# EasyEDA Pro project 51单片机（STC89C52RC）核心板.epro

# Schematic Schematic1

## Sheets
1 MCU: Board Name: Board1; Create Date: 2025-09-20; Page Name: MCU; Project Name: 51单片机（STC89C52RC）核心板; Schematic Name: Schematic1; Update Date: 2025-09-26; Company: 嘉立创EDA; Page Size: A4; Version: V1.0
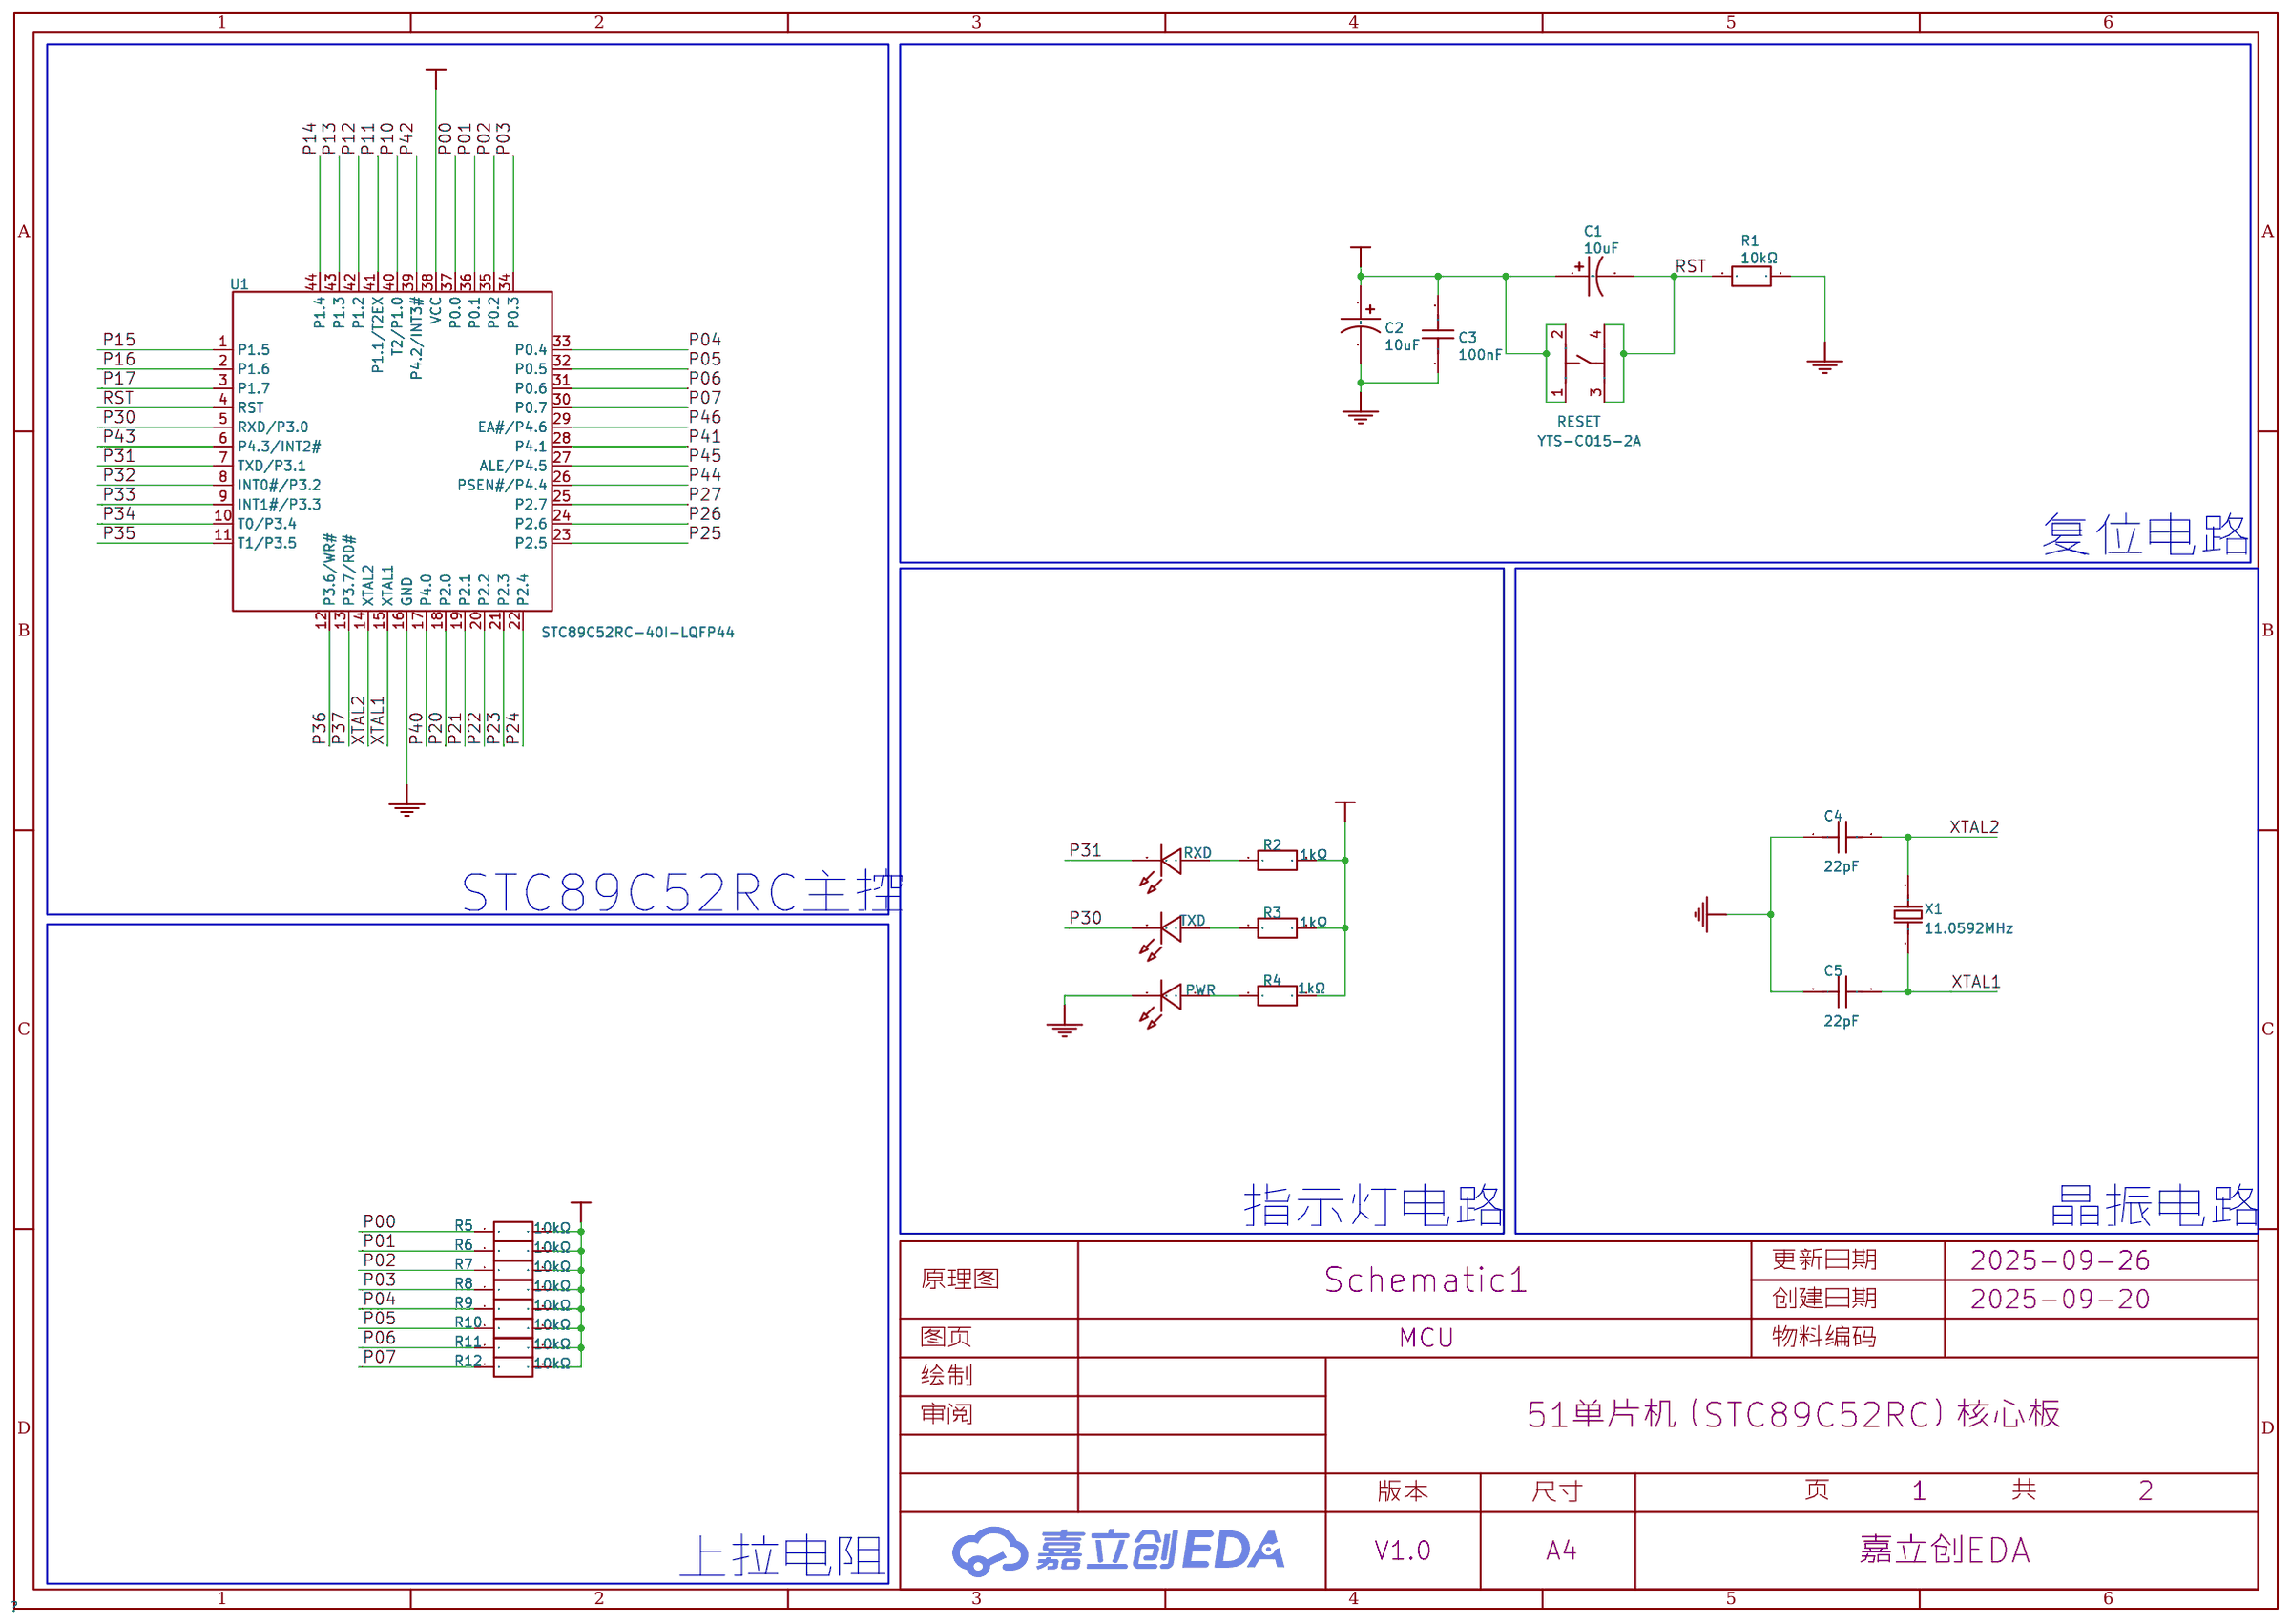
[diagram p0: MCU]
2 EX: Create Date: 2025-09-26; Page Name: EX; Update Date: 2025-09-27
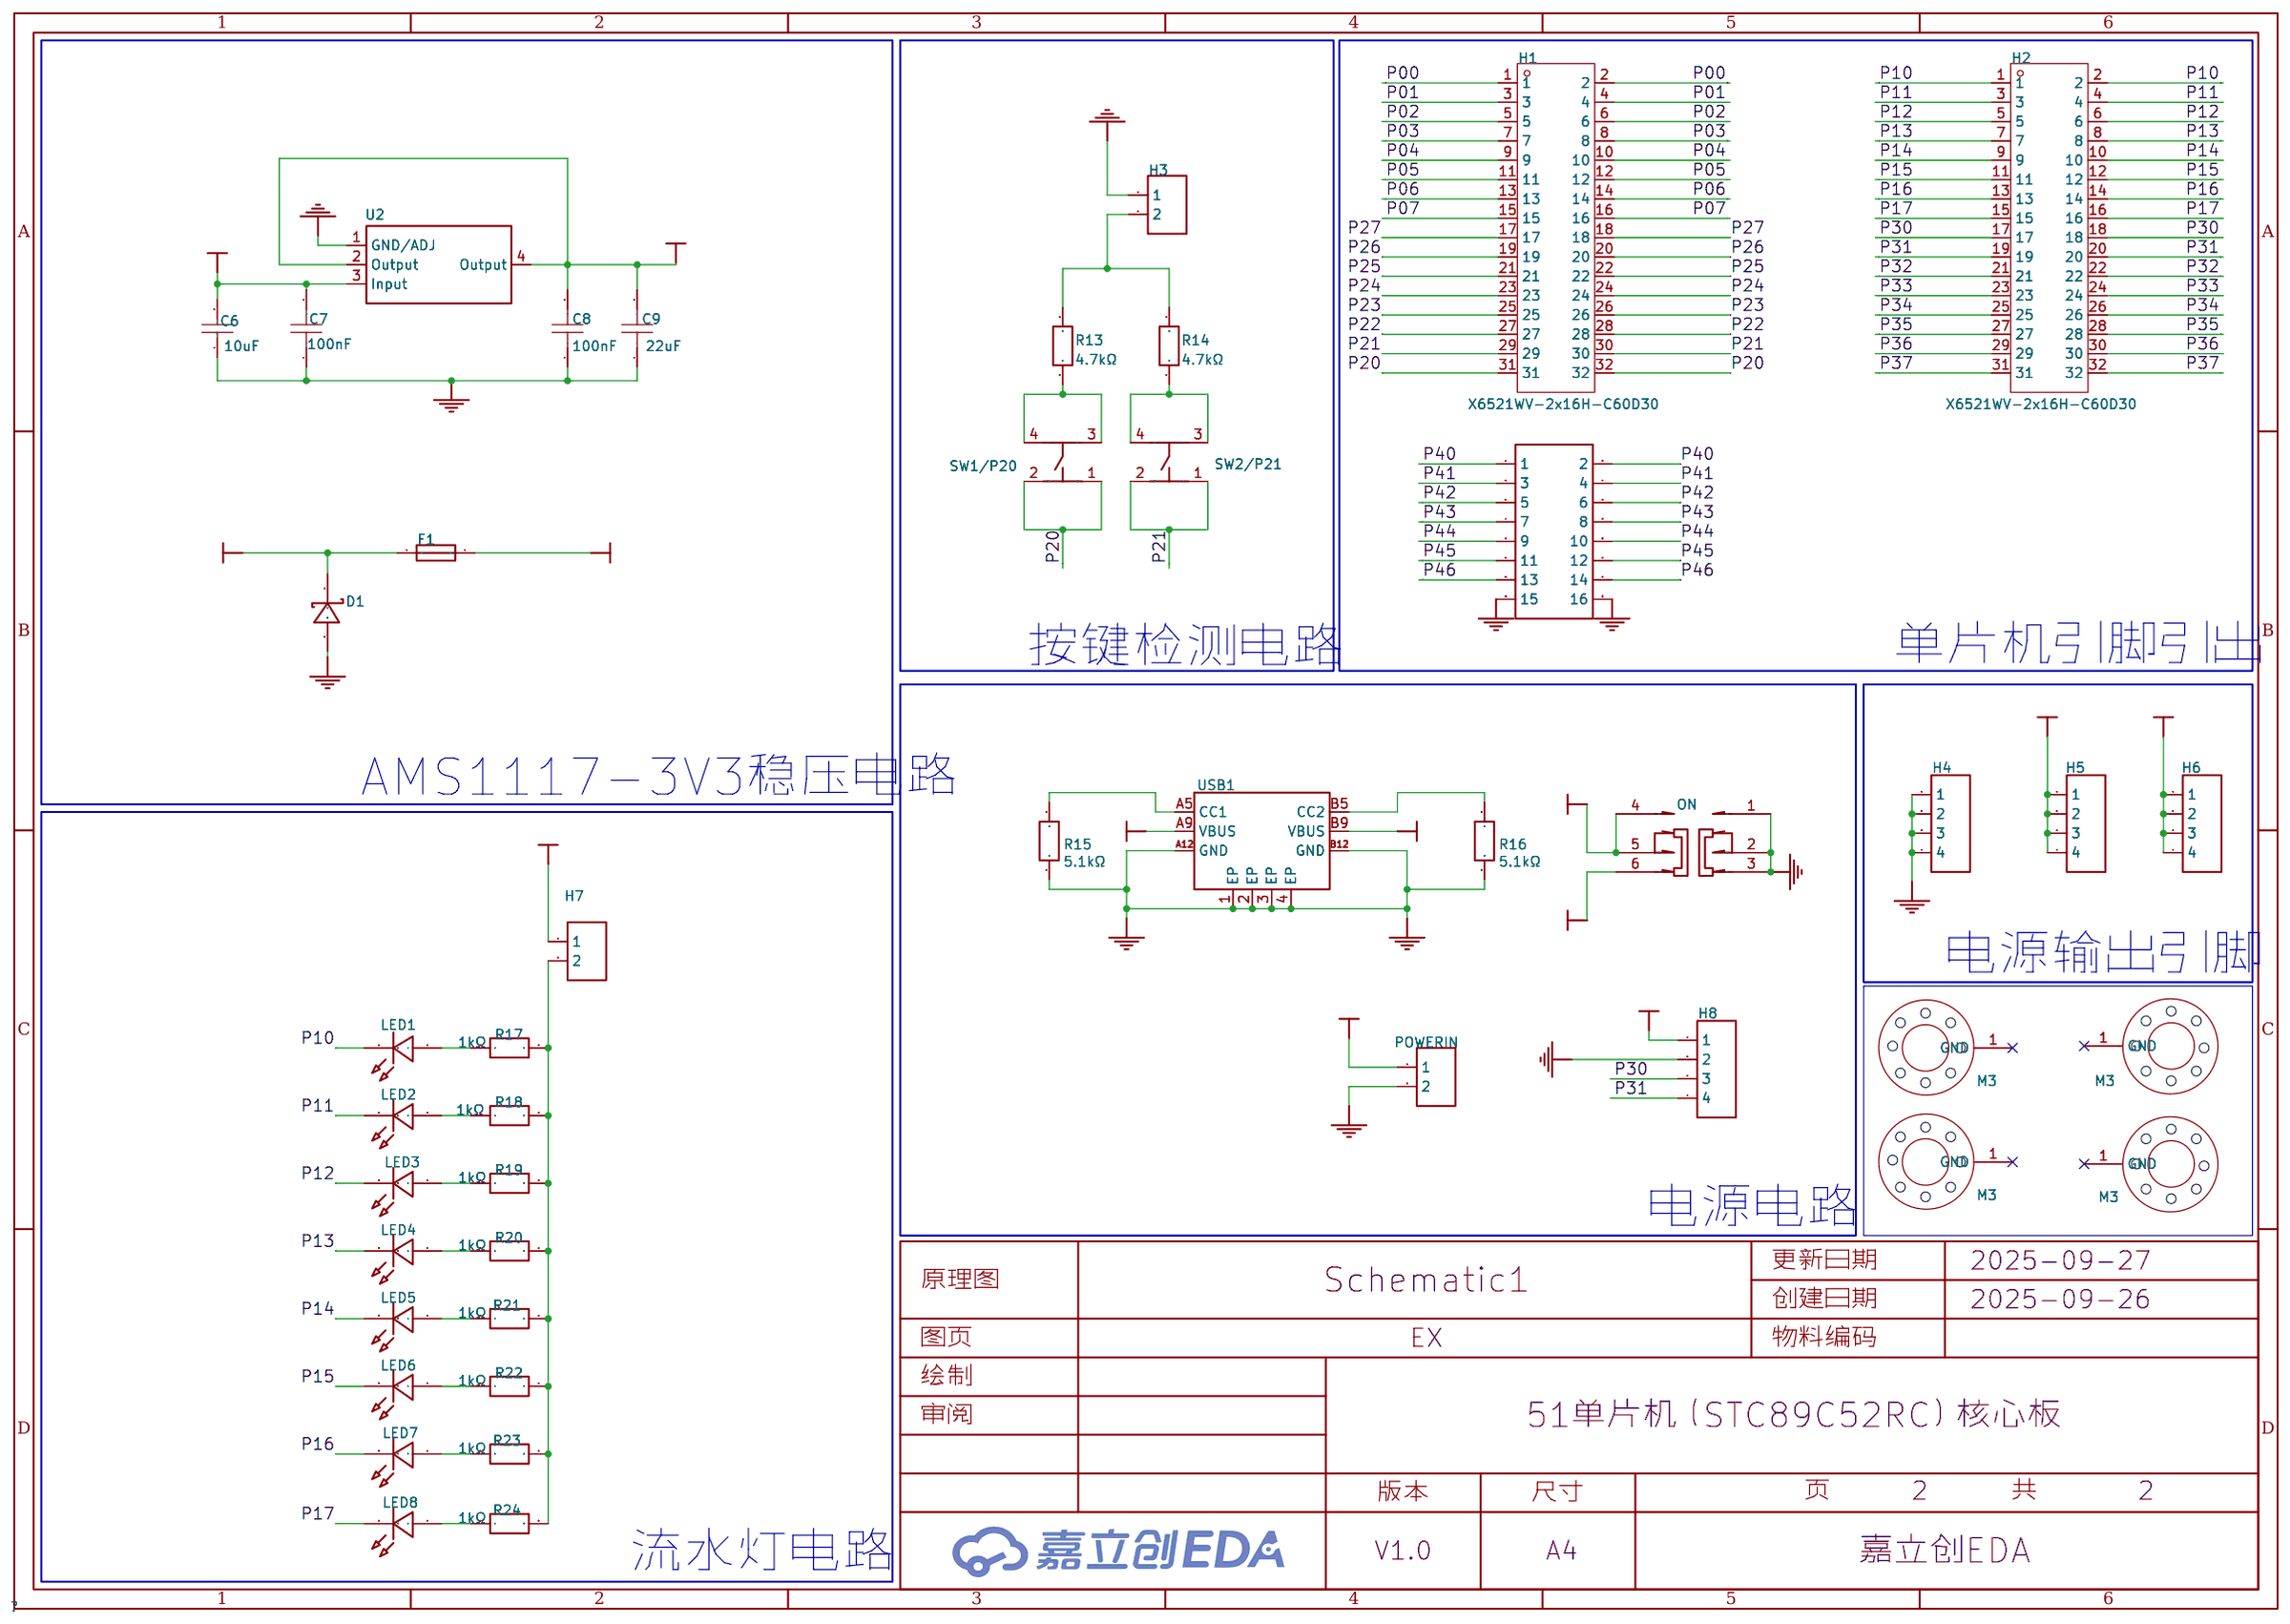
[diagram p1: EX]

## Parts
sheet EX
C6  10uF  [C0805]
C7  100nF  [C0805]
C8  100nF  [C0805]
C9  22uF  [C0805]
D1  1N5819W  [SOD-123F_L2.8-W1.8-LS3.7-RD]
F1  FSMD050-1206-R  [F1206]
H1  X6521WV-2x16H-C60D30  [HDR-TH_32P-2.54-V-M-R2-C16-S2.54]
H2  X6521WV-2x16H-C60D30  [HDR-TH_32P-2.54-V-M-R2-C16-S2.54]
H3  2.54-1*2P母  [HDR-TH_2P-P2.54-V-F]
H4  A2541HWV-4P  [HDR-TH_4P-P2.54-V_A2541HWV-4P]
H5  A2541HWV-4P  [HDR-TH_4P-P2.54-V_A2541HWV-4P]
H6  A2541HWV-4P  [HDR-TH_4P-P2.54-V_A2541HWV-4P]
H7  2.54-1*2P母  [HDR-TH_2P-P2.54-V-F]
H8  A2541HWV-4P  [HDR-TH_4P-P2.54-V_A2541HWV-4P]
hole1  M3  [m3梅花孔]
hole2  M3  [m3梅花孔]
hole3  M3  [m3梅花孔]
hole4  M3  [m3梅花孔]
J1  2.54-2*8P针  [HDR-TH_16P-P2.54-V-M-R2-C8-S2.54]
LED1  D-B080508B1-KS2  [LED0805-RD]
LED2  D-B080508B1-KS2  [LED0805-RD]
LED3  D-B080508B1-KS2  [LED0805-RD]
LED4  D-B080508B1-KS2  [LED0805-RD]
LED5  D-B080508B1-KS2  [LED0805-RD]
LED6  D-B080508B1-KS2  [LED0805-RD]
LED7  D-B080508B1-KS2  [LED0805-RD]
LED8  D-B080508B1-KS2  [LED0805-RD]
ON  SS-3235S-L1  [SW-SMD_SS-3235S-LX]
POWERIN  2.54-1*2P母  [HDR-TH_2P-P2.54-V-F]
R13  4.7kΩ  [R0805]
R14  4.7kΩ  [R0805]
R15  5.1kΩ  [R0805]
R16  5.1kΩ  [R0805]
R17  1kΩ  [R0805]
R18  1kΩ  [R0805]
R19  1kΩ  [R0805]
R20  1kΩ  [R0805]
R21  1kΩ  [R0805]
R22  1kΩ  [R0805]
R23  1kΩ  [R0805]
R24  1kΩ  [R0805]
SW1/P20  YTS-C015-2A  [SW-SMD_4P-L4.5-W4.5-P3.00-LS6.8]
SW2/P21  YTS-C015-2A  [SW-SMD_4P-L4.5-W4.5-P3.00-LS6.8]
U2  AMS1117-3.3  [SOT-223-4_L6.5-W3.5-P2.30-LS7.0-BR]
USB1  KH-TYPE-C-6P  [TYPE-C-SMD_TYPE-C-31-M-16]
sheet MCU
C1  10uF  [CASE-A_3216]
C2  10uF  [CASE-A_3216]
C3  100nF  [C0805]
C4  22pF  [C0805]
C5  22pF  [C0805]
PWR  D-B080508B1-KS2  [LED0805-RD]
R1  10kΩ  [R0805]
R2  1kΩ  [R0805]
R3  1kΩ  [R0805]
R4  1kΩ  [R0805]
R5  10kΩ  [R0805]
R6  10kΩ  [R0805]
R7  10kΩ  [R0805]
R8  10kΩ  [R0805]
R9  10kΩ  [R0805]
R10  10kΩ  [R0805]
R11  10kΩ  [R0805]
R12  10kΩ  [R0805]
RESET  YTS-C015-2A  [SW-SMD_4P-L4.5-W4.5-P3.00-LS6.8]
RXD  D-B080508B1-KS2  [LED0805-RD]
TXD  D-B080508B1-KS2  [LED0805-RD]
U1  STC89C52RC-40I-LQFP44  [LQFP-44_L10.0-W10.0-P0.80-LS12.0-BL]
X1  11.0592MHz  [HC-49US_L11.5-W4.5-P4.88]

## Library data of the parts
C6 = CL21A106KOQNNNE: 容值:10uF;精度:±10%;额定电压:16V;温度系数:X5R;; LCSC Part Name: 10uF ±10% 16V; Supplier Part: C1713; Manufacturer: SAMSUNG(三星); Supplier Footprint: 0805; JLCPCB Part Class: 扩展库; Datasheet: https://item.szlcsc.com/datasheet/CL21A106KOQNNNE/2065.html; Supplier: LCSC; Tolerance: ±10%; Voltage Rating: 16V; Temperature Coefficient: X5R
C7 C8 = FCC0805B104K500DT: 容值:100nF;精度:±10%;额定电压:50V;温度系数:X7R;; LCSC Part Name: 100nF ±10% 50V; Supplier Part: C5137467; Manufacturer: FOJAN(富捷); Supplier Footprint: 0805; JLCPCB Part Class: 扩展库; Datasheet: https://item.szlcsc.com/datasheet/FCC0805B104K500DT/5746969.html; Supplier: LCSC; Tolerance: ±10%; Voltage Rating: 50V; Temperature Coefficient: X7R
C9 = FCC0805X226M250FT: 容值:22uF;精度:±20%;额定电压:25V;温度系数:X5R;; LCSC Part Name: 22uF ±20% 25V; Supplier Part: C7419435; Manufacturer: FOJAN(富捷); Supplier Footprint: 0805; JLCPCB Part Class: 扩展库; Datasheet: https://item.szlcsc.com/datasheet/FCC0805X226M250FT/8393417.html; Supplier: LCSC; Tolerance: ±20%; Voltage Rating: 25V; Temperature Coefficient: X5R
D1 = 1N5819W_C169540: 正向压降(Vf):600mV@1A;直流反向耐压(Vr):40V;整流电流:1A;; LCSC Part Name: 电压:40V 电流:1A; Supplier Part: C169540; Manufacturer: 晶导微电子; Supplier Footprint: SOD-123F; JLCPCB Part Class: Extended Part; Datasheet: https://item.szlcsc.com/datasheet/1N5819W/180925.html; Supplier: LCSC; Voltage - Forward(Vf@If): 600mV@1A; Voltage - DC Reverse(Vr): 40V; Current - Rectified: 1A; Reverse Leakage Current (Ir): 1mA@40V; Operating Junction Temperature Range: -55℃~+150℃; Non-Repetitive Peak Forward Surge Current: 25A
F1 = FSMD050-1206-R: 耐压(Vmax):8V;最大电流(Imax):100A;保持电流(Ihold):500mA;跳闸电流(Itrip):1A;; LCSC Part Name: 8V 500mA 1206自恢复; Supplier Part: C220147; Manufacturer: FUZETEC(富致); Supplier Footprint: 1206; JLCPCB Part Class: Extended Part; Datasheet: https://item.szlcsc.com/datasheet/FSMD050-1206-R/220720.html; Supplier: LCSC; Voltage - Max: 8V; Current - Max: 100A; Hold Current: 500mA; Trip Current: 1A; Time to Trip(Max): 100ms; Operating Temperature: -40℃~+85℃; Length: 3.5mm; Width: 1.8mm; Height: 0.55mm
H1 H2 = X6521WV-2x16H-C60D30: 插针结构:2x16P;间距:2.54mm;行距:2.54mm;圆针/方针:方针;排数:双排;总PIN位数:32P;额定电流:3A;额定电压:250V;配合针长度:-;塑高:2.5mm;端接针长度:-;触头材质:黄铜;触头镀层:金;工作温度:-40℃~+105℃;颜色:黑色;; LCSC Part Name: 2x16P 间距:2.54mm 方针; Supplier Part: C725888; Manufacturer: XKB Connection(中国星坤); Supplier Footprint: 插件,P=2.54mm; JLCPCB Part Class: 扩展库; Datasheet: https://item.szlcsc.com/datasheet/X6521WV-2x16H-C60D30/772337.html; Supplier: LCSC; Pin Structure: 2x16P; Pitch: 2.54mm; Row Spacing: 2.54mm; Circluar Pins/Square Pins: 方针; Number of Rows: 双排; Number of Pins: 32P; Current Rating: 3A; Voltage Rating (Max): 250V; Insulation Height: 2.5mm; Contact Material: 黄铜; Contact Plating: 金; Operating Temperature: -40℃~+105℃; Color: 黑色
H3 H7 POWERIN = 2.54-1*2P母: 插孔结构:1x2P;间距:2.54mm;行距:-;安装方式:直插;排数:单排;总孔位数:2P;塑高:-;触头材质:-;触头镀层:-;; LCSC Part Name: 间距:2.54mm 1x2P 直插; Supplier Part: C49661; Manufacturer: BOOMELE(博穆精密); Supplier Footprint: 插件,P=2.54mm; JLCPCB Part Class: Extended Part; Datasheet: https://item.szlcsc.com/datasheet/2.54-1*2P%25E6%25AF%258D/50669.html; Supplier: LCSC; Holes Structure: 1x2P; Pitch: 2.54mm; Mounting Type: 直插; Number of Rows: 单排; Number of Positions: 2P
H4-H6 H8 = A2541HWV-4P: 插孔结构:1x4P;间距:2.54mm;行距:-;圆孔/方孔:方孔;安装方式:直插;排数:单排;总孔位数:4P;额定电流:3A;额定电压:250V;插孔方向:顶部;塑高:8.5mm;触头材质:黄铜;触头镀层:金;工作温度:-40℃~+105℃;; LCSC Part Name: 1x4P 间距:2.54mm 直插; Supplier Part: C225501; Manufacturer: CJT(长江连接器); Supplier Footprint: 插件,P=2.54mm; JLCPCB Part Class: Extended Part; Datasheet: https://item.szlcsc.com/datasheet/A2541HWV-4P/225784.html; Supplier: LCSC; Holes Structure: 1x4P; Pitch: 2.54mm; Circular Hole / Square Hole: 方孔; Mounting Type: 直插; Number of Rows: 单排; Number of Positions: 4P; Current Rating: 3A; Voltage Rating (Max): 250V; Holes Direction: 顶部; Insulation Height: 8.5mm; Contact Material: 黄铜; Contact Plating: 金; Operating Temperature: -40℃~+105℃; PIN Length: 3.2mm
hole1-hole4 = m3_梅花螺丝孔: 梅花螺丝孔
J1 = 2.54-2*8P针_C68234: 插针结构:2x8P;间距:2.54mm;行距:2.54mm;圆针/方针:方针;安装方式:直插;排数:双排;总PIN位数:16P;额定电流:3A;额定电压:-;配合针长度:5.9mm;塑高:2.54mm;端接针长度:3mm;触头材质:黄铜;触头镀层:金;工作温度:-55℃~+105℃;颜色:黑色;; LCSC Part Name: 2x8P 间距:2.54mm 方针 直插; Supplier Part: C68234; Manufacturer: BOOMELE(博穆精密); Supplier Footprint: 插件,P=2.54mm; JLCPCB Part Class: Extended Part; Datasheet: https://item.szlcsc.com/datasheet/2.54-2*8P%25E9%2592%2588/69336.html; Supplier: LCSC; Pin Structure: 2x8P; Pitch: 2.54mm; Row Spacing: 2.54mm; Circluar Pins/Square Pins: 方针; Mounting Type: 直插; Number of Rows: 双排; Number of Pins: 16P; Current Rating: 3A; Length of Mating Pin: 5.9mm; Insulation Height: 2.54mm; Length of End Connection Pin: 3mm; Contact Material: 黄铜; Contact Plating: 金; Operating Temperature: -55℃~+105℃; Color: 黑色
LED1-LED8 PWR RXD TXD = D-B080508B1-KS2: 发光颜色:蓝色;; LCSC Part Name: 蓝灯; Supplier Part: C108412; Manufacturer: ARKLED(方舟); Supplier Footprint: 0805; JLCPCB Part Class: Extended Part; Datasheet: https://atta.szlcsc.com/upload/public/pdf/source/20170505/1493957852061.pdf; Supplier: LCSC; Emitted Color: 蓝色
ON = SS-3235S-L1: 电路结构:双刀双掷;安装方式:卧贴;开关颜色:黑色;额定电流:50mA;额定电压:12V;工作寿命:1万次;; LCSC Part Name: 柄长2mm 卧贴双档 滑动开关; Supplier Part: C500055; Manufacturer: XKB Connection(中国星坤); Supplier Footprint: SMD; JLCPCB Part Class: Extended Part; Datasheet: https://atta.szlcsc.com/upload/public/pdf/source/20211011/39D516E750C13BE9339464E723D9F132.pdf; Supplier: LCSC; Circuit: 双刀双掷; Actuator Style: 矩形柱状; Pin Style: 鸥翼型; Switch Length: 9.1mm; Switch Width: 3.55mm; Switch Height: 3.2mm; Mounting Style: 卧贴; Actuator Color: 黑色; Current Rating (DC): 50mA; Voltage Rating (DC): 12V; Current Rating (AC): 50mA; Voltage Rating (AC): 12V; Mechanical Life: 1万次; Operating Temperature: -40℃~+85℃; Termination Style: 鸥翼型; Length: 9.1mm; Width: 3.55mm; Mounting Type: 卧贴; Current Rating: 50mA; Voltage Rating: 12V; Life: 1万次
R13 R14 = 0805W8F4701T5E: 电阻类型:厚膜电阻;阻值:4.7kΩ;精度:±1%;功率:125mW;最大工作电压:150V;温度系数:±100ppm/℃;; LCSC Part Name: 4.7kΩ ±1% 125mW 厚膜电阻; Supplier Part: C17673; Manufacturer: UNI-ROYAL(厚声); Supplier Footprint: 0805; JLCPCB Part Class: Basic Part; Datasheet: https://atta.szlcsc.com/upload/public/pdf/source/20200306/C422600_1E6D84923E4A46A82E41ADD87F860B5C.pdf; Supplier: LCSC; Type: 厚膜电阻; Tolerance: ±1%; Power(Watts): 125mW; Overload Voltage (Max): 150V; Temperature Coefficient: ±100ppm/℃; Operating Temperature Range: -55℃~+155℃
R15 R16 = 0805W8F5101T5E: 电阻类型:厚膜电阻;阻值:5.1kΩ;精度:±1%;功率:125mW;工作电压:150V;温度系数:±100ppm/℃;; LCSC Part Name: 5.1kΩ ±1% 125mW 厚膜电阻; Supplier Part: C27834; Manufacturer: UNI-ROYAL(厚声); Supplier Footprint: 0805; JLCPCB Part Class: 基础库; Datasheet: https://item.szlcsc.com/datasheet/0805W8F5101T5E/28584.html; Supplier: LCSC; Type: 厚膜电阻; Tolerance: ±1%; Power(Watts): 125mW; Voltage-Supply(Max): 150V; Temperature Coefficient: ±100ppm/℃; Operating Temperature: -55℃~+155℃
R2-R4 R17-R24 = 0805W8F1001T5E: 电阻类型:厚膜电阻;阻值:1kΩ;精度:±1%;功率:125mW;最大工作电压:150V;温度系数:±100ppm/℃;; LCSC Part Name: 1kΩ ±1% 125mW 厚膜电阻; Supplier Part: C17513; Manufacturer: UNI-ROYAL(厚声); Supplier Footprint: 0805; JLCPCB Part Class: 基础库; Datasheet: https://atta.szlcsc.com/upload/public/pdf/source/20200306/C422600_1E6D84923E4A46A82E41ADD87F860B5C.pdf; Supplier: LCSC; Type: 厚膜电阻; Tolerance: ±1%; Power(Watts): 125mW; Overload Voltage (Max): 150V; Temperature Coefficient: ±100ppm/℃; Operating Temperature Range: -55℃~+155℃
RESET SW1/P20 SW2/P21 = YTS-C015-2A: 电路结构:单刀单掷;按钮形状:圆形按钮;作用力:2.6N;安装方式:立贴;开关长度:4.5mm;开关宽度:4.5mm;开关高度:3.5mm;带支架:不带支架;触点电流:50mA;额定电压:12V;工作寿命:5万次;; LCSC Part Name: 4.5*4.5*3.5mm 立贴 轻触开关; Supplier Part: C2910843; Manufacturer: YIYUAN(怡远); Supplier Footprint: SMD-4P,4.5x4.5mm; JLCPCB Part Class: Extended Part; Datasheet: https://item.szlcsc.com/datasheet/YTS-C015-2A/3190226.html; Supplier: LCSC; Circuit: 单刀单掷; Actuator Style: 圆形按钮; Operating Force: 2.6N; Mounting Type: 立贴; Length: 4.5mm; Width: 4.5mm; Switch Height: 3.5mm; with Bracket: 不带支架; Contact Current: 50mA; Voltage Rating: 12V; Actuator/Cap Color: 黑色; Termination Style: 鸥翼型; Life: 5万次
U2 = AMS1117-3.3_C369933: 输出类型:固定;工作电压:18V;输出电压:3.3V;输出电流:1A;电源纹波抑制比(PSRR):-;输出极性:正极;; LCSC Part Name: 输入18V 输出3.3V 1A; Supplier Part: C369933; Manufacturer: KEXIN(科信); Supplier Footprint: SOT-223-4; JLCPCB Part Class: Extended Part; Datasheet: https://atta.szlcsc.com/upload/public/pdf/source/20190724/C369933_94137CB0CFA8D6ABD8E5DA714A2C2C4B.pdf; Supplier: LCSC; Output Type: 固定; Voltage - Supply: 18V; Output Voltage: 3.3V; Output Current: 1A; Voltage Dropout: 1.3V@(800mA); standby current: 8mA; Features: 过热保护; Output Configuration: 正极; Number of Outputs: 1
USB1 = KH-TYPE-C-6P_C709355: 连接器类型:Type-C;协议标准:-;公母:母;安装方式:卧贴;触点数量:6P;端口数量:1;额定电流 - 电源:5A;工作温度:-25℃~+85℃;; LCSC Part Name: Type-C 母 卧贴; Supplier Part: C709355; Manufacturer: kinghelm(金航标); Supplier Footprint: SMD; JLCPCB Part Class: Extended Part; Datasheet: https://atta.szlcsc.com/upload/public/pdf/source/20250117/2540434738F6D484C036EB4C5EFDD029.pdf; Supplier: LCSC; Connector Type: Type-C; Gender: 母; Mounting Type: 卧贴; Number of Contacts: 6P; Number of Ports: 1; Current Rating-Power: 5A; Operating Temperature: -25℃~+85℃
C1 C2 = TAJA106K010RNJ: 容值:10uF;精度:±10%;额定电压:10V;等效串联电阻(ESR):3Ω@100kHz;; LCSC Part Name: 10uF ±10% 10V; Supplier Part: C7177; Manufacturer: Kyocera AVX; Supplier Footprint: CASE-A-3216-18(mm); JLCPCB Part Class: Extended Part; Supplier: LCSC; Tolerance: ±10%; Voltage Rating: 10V; Equivalent Series Resistance(ESR): 3Ω@100kHz; Operating Temperature: -55℃~+125℃
C3 = CC0805KRX7R9BB104: 容值:100nF;精度:±10%;额定电压:50V;温度系数:X7R;; LCSC Part Name: 100nF ±10% 50V; Supplier Part: C49678; Manufacturer: YAGEO(国巨); Supplier Footprint: 0805; JLCPCB Part Class: Basic Part; Datasheet: https://item.szlcsc.com/datasheet/CC0805KRX7R9BB104/50686.html; Supplier: LCSC; Tolerance: ±10%; Voltage Rating: 50V; Temperature Coefficient: X7R
C4 C5 = CL21C220JBANNNC: 容值:22pF;精度:±5%;额定电压:50V;温度系数:C0G;; LCSC Part Name: 22pF ±5% 50V; Supplier Part: C1804; Manufacturer: SAMSUNG(三星); Supplier Footprint: 0805; JLCPCB Part Class: Basic Part; Datasheet: https://item.szlcsc.com/datasheet/CL21C220JBANNNC/2156.html; Supplier: LCSC; Tolerance: ±5%; Voltage Rating: 50V; Temperature Coefficient: C0G
R1 R5-R12 = 0805W8F1002T5E_C17414: 电阻类型:厚膜电阻;阻值:10kΩ;精度:±1%;功率:125mW;工作电压:150V;温度系数:±100ppm/℃;; LCSC Part Name: 10kΩ ±1% 125mW 厚膜电阻; Supplier Part: C17414; Manufacturer: UNI-ROYAL(厚声); Manufacturer Part: 0805W8F1002T5E; Supplier Footprint: 0805; JLCPCB Part Class: Basic Part; Datasheet: https://item.szlcsc.com/datasheet/0805W8F1002T5E/18102.html; Supplier: LCSC; Type: 厚膜电阻; Tolerance: ±1%; Power(Watts): 125mW; Voltage-Supply(Max): 150V; Temperature Coefficient: ±100ppm/℃; Operating Temperature: -55℃~+155℃
U1 = STC89C52RC-40I-LQFP44: CPU内核:51系列;应用领域:-;; Supplier Part: C8707; Manufacturer: STC; Supplier Footprint: LQFP-44(10x10); JLCPCB Part Class: Extended Part; Datasheet: https://atta.szlcsc.com/upload/public/pdf/source/20241226/242305099CBBF4767F79975207B2F263.pdf; Supplier: LCSC; CPU Core: 51系列; Program Storage Size: 8KB; Program Memory Type: FLASH; Number of I/O: 39; Low Voltage Detection Threshold: 3.3V~5.5V
X1 = TAXD11.0592M2GLFBET2T: 晶振类型:直插晶振;频率:11.0592MHz;常温频差:±30ppm;负载电容:20pF;频率稳定度:±30ppm;; LCSC Part Name: 11.0592MHz ±30ppm 20pF; Supplier Part: C127675; Manufacturer: YJX(雅晶鑫); Supplier Footprint: HC-49S; JLCPCB Part Class: Extended Part; Datasheet: https://item.szlcsc.com/datasheet/TAXD11.0592M2GLFBET2T/138958.html; Supplier: LCSC; Type: 直插晶振; Normal temperature Frequency Tolerance: ±30ppm; Load Capacitance: 20pF; Frequency Stability: ±30ppm; Equivalent Series Resistance(ESR): 50Ω; Operating Temperature: -20℃~+70℃

## Nets
3V3: C8.2 C9.2 H6.1 H6.2 H6.3 H6.4 U2.2(Output) U2.4(Output)
+5V: C1.1 C2.1 C3.2 C6.2 C7.2 D1.1 F1.2 H5.1 H5.2 H5.3 H5.4 H7.1 H8.1 R2.2 R3.2 R4.2 R5.2 R6.2 R7.2 R8.2 R9.2 R10.2 R11.2 R12.2 RESET.1 RESET.2 U1.38(VCC) U2.3(Input)
GND: C2.2 C3.1 C4.1 C5.2 C6.1 C7.1 C8.1 C9.1 D1.2 H3.1 H4.1 H4.2 H4.3 H4.4 H8.2 J1.15 J1.16 ON.1 ON.2 ON.3 POWERIN.2 PWR.2 R1.2 R15.1 R16.1 U1.16(GND) U2.1(GND/ADJ) USB1.1(EP) USB1.2(EP) USB1.3(EP) USB1.4(EP) USB1.A12(GND) USB1.B12(GND)
VCC: ON.4 ON.5 POWERIN.1 USB1.A9(VBUS) USB1.B9(VBUS)
VCCX: F1.1 ON.6
P00: H1.1 H1.2 R5.1 U1.37(P0.0)
P01: H1.3 H1.4 R6.1 U1.36(P0.1)
P02: H1.5 H1.6 R7.1 U1.35(P0.2)
P03: H1.7 H1.8 R8.1 U1.34(P0.3)
P04: H1.9 H1.10 R9.1 U1.33(P0.4)
P05: H1.11 H1.12 R10.1 U1.32(P0.5)
P06: H1.13 H1.14 R11.1 U1.31(P0.6)
P07: H1.15 H1.16 R12.1 U1.30(P0.7)
P10: H2.1 H2.2 LED1.2 U1.40(T2/P1.0)
P11: H2.3 H2.4 LED2.2 U1.41(P1.1/T2EX)
P12: H2.5 H2.6 LED3.2 U1.42(P1.2)
P13: H2.7 H2.8 LED4.2 U1.43(P1.3)
P14: H2.9 H2.10 LED5.2 U1.44(P1.4)
P15: H2.11 H2.12 LED6.2 U1.1(P1.5)
P16: H2.13 H2.14 LED7.2 U1.2(P1.6)
P17: H2.15 H2.16 LED8.2 U1.3(P1.7)
P20: H1.31 H1.32 SW1/P20.1 SW1/P20.2 U1.18(P2.0)
P21: H1.29 H1.30 SW2/P21.1 SW2/P21.2 U1.19(P2.1)
P22: H1.27 H1.28 U1.20(P2.2)
P23: H1.25 H1.26 U1.21(P2.3)
P24: H1.23 H1.24 U1.22(P2.4)
P25: H1.21 H1.22 U1.23(P2.5)
P26: H1.19 H1.20 U1.24(P2.6)
P27: H1.17 H1.18 U1.25(P2.7)
P30: H2.17 H2.18 H8.3 TXD.2 U1.5(RXD/P3.0)
P31: H2.19 H2.20 H8.4 RXD.2 U1.7(TXD/P3.1)
P32: H2.21 H2.22 U1.8(INT0#/P3.2)
P33: H2.23 H2.24 U1.9(INT1#/P3.3)
P34: H2.25 H2.26 U1.10(T0/P3.4)
P35: H2.27 H2.28 U1.11(T1/P3.5)
P36: H2.29 H2.30 U1.12(P3.6/WR#)
P37: H2.31 H2.32 U1.13(P3.7/RD#)
P40: J1.1 J1.2 U1.17(P4.0)
P41: J1.3 J1.4 U1.28(P4.1)
P42: J1.5 J1.6 U1.39(P4.2/INT3#)
P43: J1.7 J1.8 U1.6(P4.3/INT2#)
P44: J1.9 J1.10 U1.26(PSEN#/P4.4)
P45: J1.11 J1.12 U1.27(ALE/P4.5)
P46: J1.13 J1.14 U1.29(EA#/P4.6)
RST: C1.2 R1.1 RESET.3 RESET.4 U1.4(RST)
XTAL1: C5.1 U1.15(XTAL1) X1.1
XTAL2: C4.2 U1.14(XTAL2) X1.2
$1N5139: R2.1 RXD.1
$1N5140: R3.1 TXD.1
$1N5141: PWR.1 R4.1
$2N1911: LED8.1 R24.1
$2N1912: H7.2 R17.2 R18.2 R19.2 R20.2 R21.2 R22.2 R23.2 R24.2
$2N1913: LED7.1 R23.1
$2N1914: LED5.1 R21.1
$2N1915: LED6.1 R22.1
$2N1922: LED4.1 R20.1
$2N1923: LED3.1 R19.1
$2N1932: LED2.1 R18.1
$2N1933: LED1.1 R17.1
$2N1937: H3.2 R13.2 R14.2
$2N1939: R13.1 SW1/P20.3 SW1/P20.4
$2N1940: R14.1 SW2/P21.3 SW2/P21.4
$2N2109: R16.2 USB1.B5(CC2)
$2N2110: R15.2 USB1.A5(CC1)

Not connected (* = marked no-connect by the designer): hole1 1(GND)*; hole2 1(GND)*; hole3 1(GND)*; hole4 1(GND)*

## Notes on the sheets
sheet 1
- 复位电路
- STC89C52RC主控
- 指示灯电路
- 晶振电路
- 上拉电阻
sheet 2
- 按键检测电路
- 单片机引脚引出
- AMS1117-3V3稳压电路
- 电源输出引脚
- 电源电路
- 流水灯电路

# Board PCB1
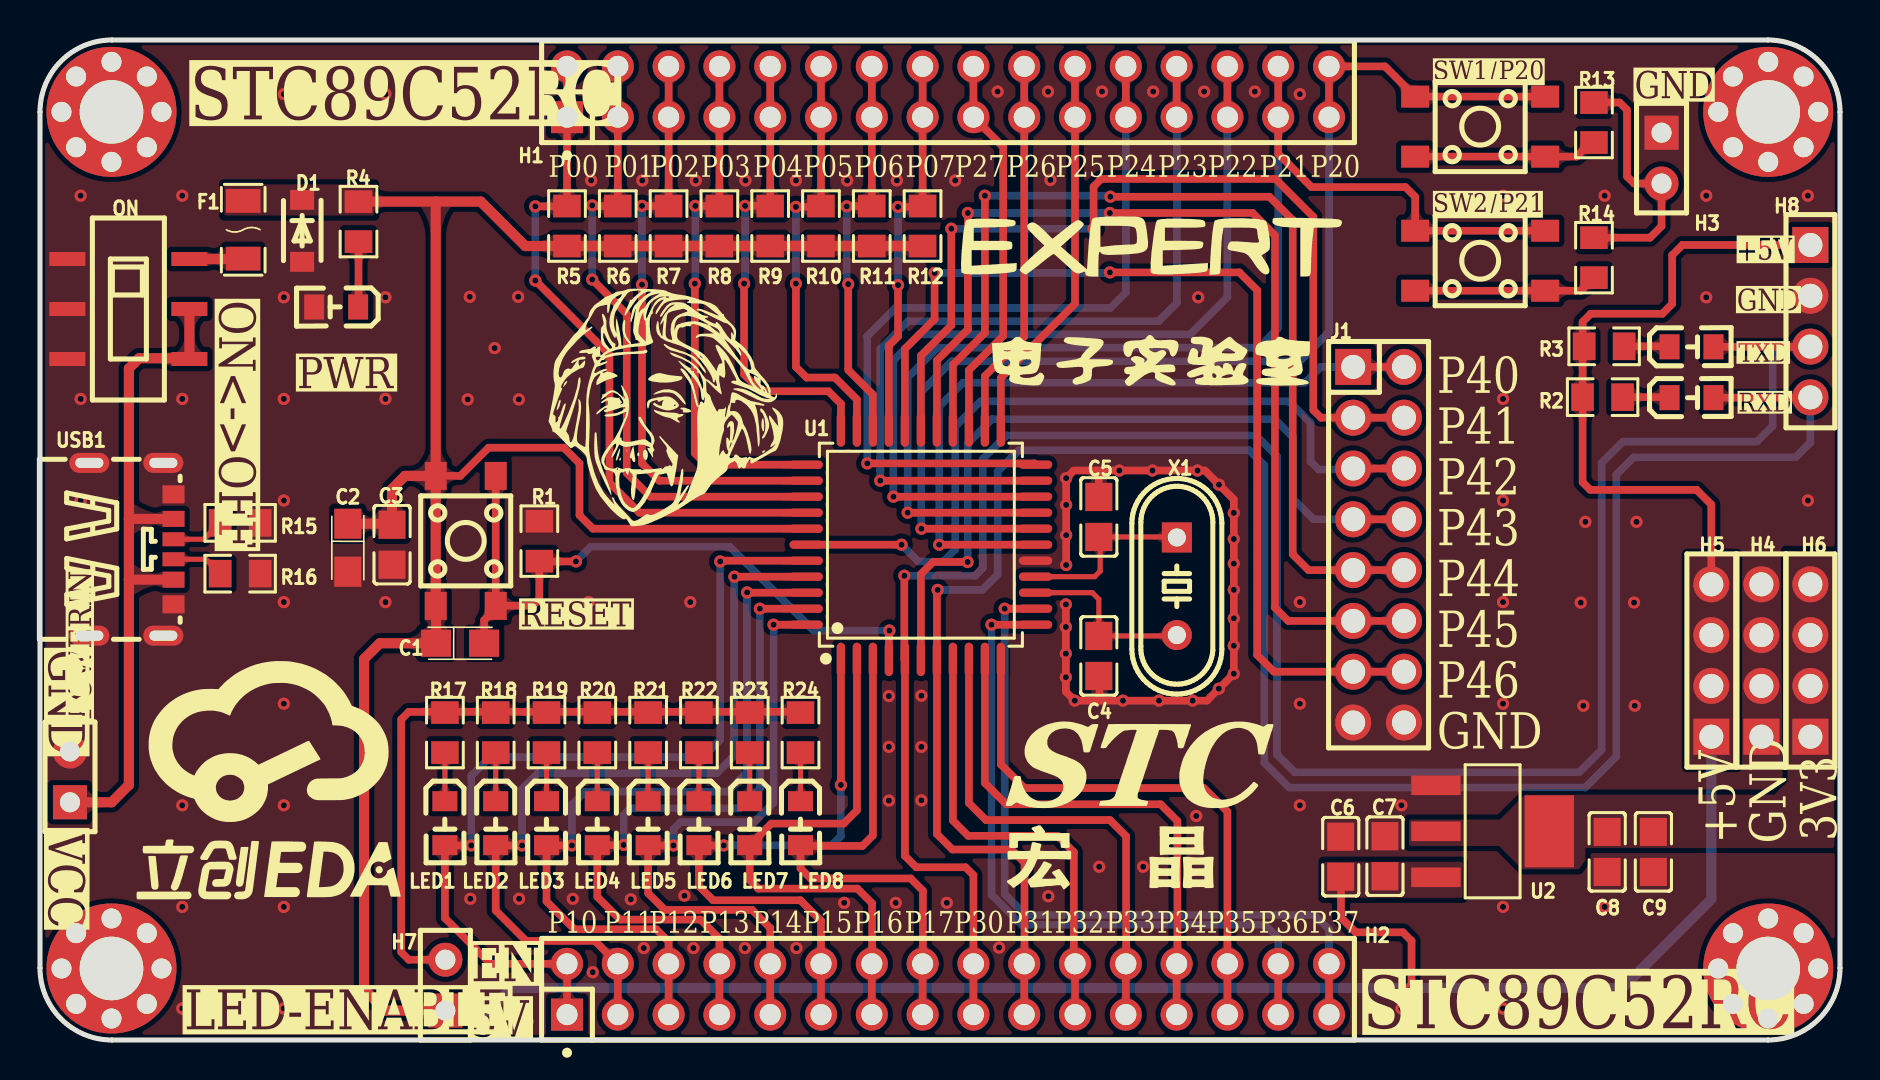
[diagram p2: board, top side]
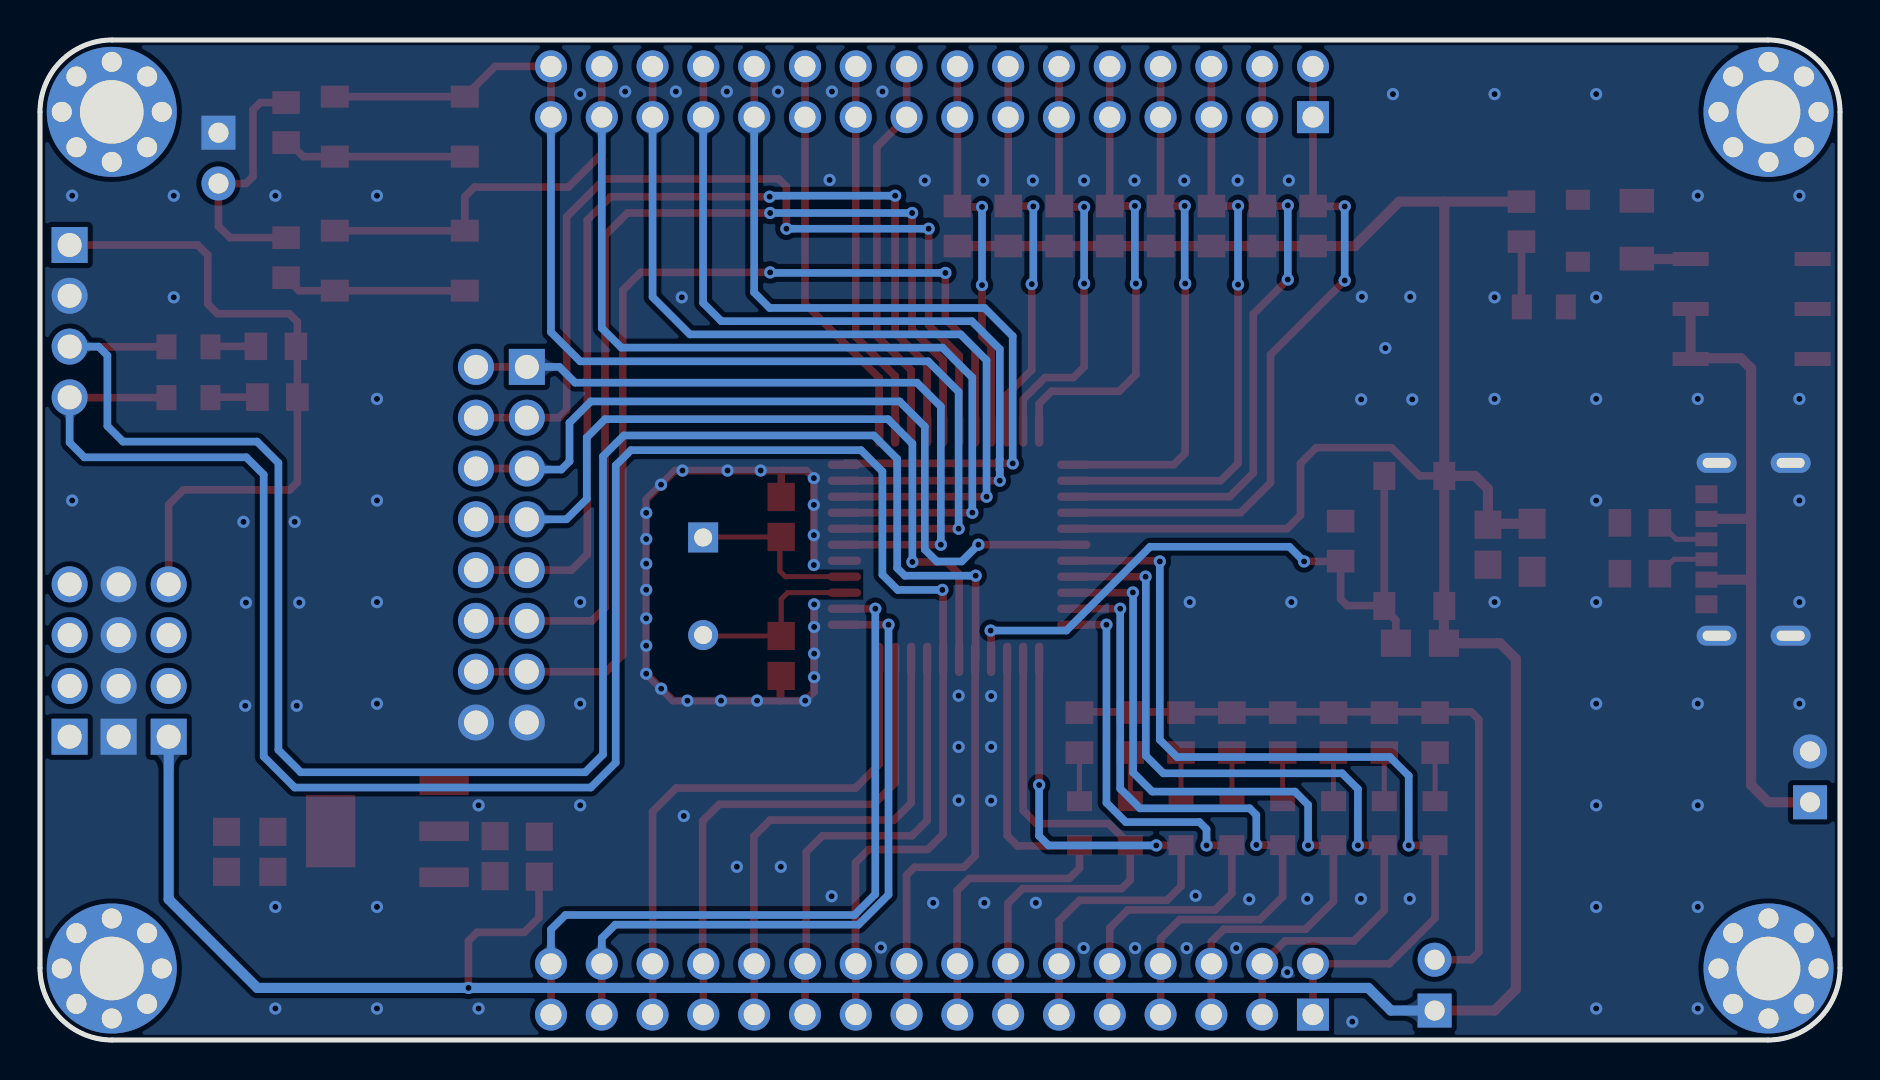
[diagram p3: board, bottom side, seen from below]

Outline 90 x 50 mm; copper layers: Top Layer, Bottom Layer. Coordinates in mm from the lower left corner of the outline.
Outline path: 0,46.4 0,3.6 arc(1.05,1.05) 3.6,0 86.4,0 arc(88.95,1.05) 90,3.6 90,46.4 arc(88.95,48.95) 86.4,50 3.6,50 arc(1.05,48.95) 0,46.4
Stack: Top Layer 0.035mm / Dielectric1 1.51mm FR4 er 4.5 / Bottom Layer 0.035mm

## Design rules (mm)
template: 自定义配置
spacing copperThickness1oz (default): track to track 0.102, other pairs 0.152 to 0.3
spacing copperThickness2oz: track to track 0.203, other pairs 0.152 to 0.3
track width copperThickness1oz (default): min 0.127, default 0.381, max 2.54
track width copperThickness2oz: min 0.203, default 0.254, max 2.54
differential pair differentialPair (default): width min 0.127, default 0.254, max 2.54; gap min 0.152, default 0.152
via viaSize (default): diameter min 0.5, default 0.61, max 10; hole min 0.3, default 0.305, max 6.3

## Placement (name value [footprint] x y rotation side)
C1  10uF  [CASE-A_3216]  21.01 19.84 0 top
C2  10uF  [CASE-A_3216]  15.39 24.61 270 top
C3  100nF  [C0805]  17.6 24.77 90 top
C4  22pF  [C0805]  52.94 19.2 90 top
C5  22pF  [C0805]  52.94 26.15 90 top
C6  10uF  [C0805]  65.04 9.17 270 top
C7  100nF  [C0805]  67.25 9.19 270 top
C8  100nF  [C0805]  78.36 9.41 90 top
C9  22uF  [C0805]  80.67 9.41 90 top
D1  1N5819W  [SOD-123F_L2.8-W1.8-LS3.7-RD]  13.11 40.46 270 top
F1  FSMD050-1206-R  [F1206]  10.16 40.51 90 top
H1  X6521WV-2x16H-C60D30  [HDR-TH_32P-2.54-V-M-R2-C16-S2.54]  45.4 47.41 0 top
H2  X6521WV-2x16H-C60D30  [HDR-TH_32P-2.54-V-M-R2-C16-S2.54]  45.4 2.54 0 top
H3  2.54-1*2P母  [HDR-TH_2P-P2.54-V-F]  81.08 44.09 270 top
H4  A2541HWV-4P  [HDR-TH_4P-P2.54-V_A2541HWV-4P]  86.07 18.97 90 top
H5  A2541HWV-4P  [HDR-TH_4P-P2.54-V_A2541HWV-4P]  83.57 18.97 90 top
H6  A2541HWV-4P  [HDR-TH_4P-P2.54-V_A2541HWV-4P]  88.52 18.97 90 top
H7  2.54-1*2P母  [HDR-TH_2P-P2.54-V-F]  20.27 2.74 90 top
H8  A2541HWV-4P  [HDR-TH_4P-P2.54-V_A2541HWV-4P]  88.52 35.94 270 top
hole1  M3  [m3梅花孔]  3.57 46.41 0 top
hole2  M3  [m3梅花孔]  86.41 46.41 0 top
hole3  M3  [m3梅花孔]  3.57 3.58 0 top
hole4  M3  [m3梅花孔]  86.41 3.58 0 top
J1  2.54-2*8P针  [HDR-TH_16P-P2.54-V-M-R2-C8-S2.54]  66.93 24.77 270 top
LED1  D-B080508B1-KS2  [LED0805-RD]  20.25 10.84 270 top
LED2  D-B080508B1-KS2  [LED0805-RD]  22.79 10.84 270 top
LED3  D-B080508B1-KS2  [LED0805-RD]  25.33 10.84 270 top
LED4  D-B080508B1-KS2  [LED0805-RD]  27.87 10.84 270 top
LED5  D-B080508B1-KS2  [LED0805-RD]  30.41 10.84 270 top
LED6  D-B080508B1-KS2  [LED0805-RD]  32.95 10.84 270 top
LED7  D-B080508B1-KS2  [LED0805-RD]  35.49 10.84 270 top
LED8  D-B080508B1-KS2  [LED0805-RD]  38.03 10.84 270 top
ON  SS-3235S-L1  [SW-SMD_SS-3235S-LX]  4.42 36.55 90 top
POWERIN  2.54-1*2P母  [HDR-TH_2P-P2.54-V-F]  1.5 13.16 90 top
PWR  D-B080508B1-KS2  [LED0805-RD]  14.81 36.65 180 top
R1  10kΩ  [R0805]  24.97 24.94 90 top
R2  1kΩ  [R0805]  78.13 32.14 180 top
R3  1kΩ  [R0805]  78.21 34.68 180 top
R4  1kΩ  [R0805]  15.93 40.92 90 top
R5  10kΩ  [R0805]  26.35 40.7 270 top
R6  10kΩ  [R0805]  28.89 40.7 270 top
R7  10kΩ  [R0805]  31.43 40.7 270 top
R8  10kΩ  [R0805]  33.97 40.7 270 top
R9  10kΩ  [R0805]  36.51 40.7 270 top
R10  10kΩ  [R0805]  39.05 40.7 270 top
R11  10kΩ  [R0805]  41.59 40.7 270 top
R12  10kΩ  [R0805]  44.13 40.7 270 top
R13  4.7kΩ  [R0805]  77.7 45.87 90 top
R14  4.7kΩ  [R0805]  77.7 39.12 90 top
R15  5.1kΩ  [R0805]  10.01 25.86 180 top
R16  5.1kΩ  [R0805]  10.01 23.32 180 top
R17  1kΩ  [R0805]  20.25 15.37 90 top
R18  1kΩ  [R0805]  22.79 15.37 90 top
R19  1kΩ  [R0805]  25.33 15.37 90 top
R20  1kΩ  [R0805]  27.87 15.37 90 top
R21  1kΩ  [R0805]  30.41 15.37 90 top
R22  1kΩ  [R0805]  32.95 15.37 90 top
R23  1kΩ  [R0805]  35.49 15.37 90 top
R24  1kΩ  [R0805]  38.03 15.37 90 top
RESET  YTS-C015-2A  [SW-SMD_4P-L4.5-W4.5-P3.00-LS6.8]  21.29 24.95 90 top
RXD  D-B080508B1-KS2  [LED0805-RD]  82.58 32.12 0 top
SW1/P20  YTS-C015-2A  [SW-SMD_4P-L4.5-W4.5-P3.00-LS6.8]  72.01 45.67 0 top
SW2/P21  YTS-C015-2A  [SW-SMD_4P-L4.5-W4.5-P3.00-LS6.8]  72.01 38.96 0 top
TXD  D-B080508B1-KS2  [LED0805-RD]  82.58 34.66 0 top
U1  STC89C52RC-40I-LQFP44  [LQFP-44_L10.0-W10.0-P0.80-LS12.0-BL]  44.04 24.77 0 top
U2  AMS1117-3.3  [SOT-223-4_L6.5-W3.5-P2.30-LS7.0-BR]  72.63 10.44 180 top
USB1  KH-TYPE-C-6P  [TYPE-C-SMD_TYPE-C-31-M-16]  4.57 24.54 270 top
X1  11.0592MHz  [HC-49US_L11.5-W4.5-P4.88]  56.84 22.69 270 top

## Footprints (pads in the part's own frame, mm; a bottom-side part is the same pattern mirrored in y, then rotated)
C0805
  rect 1.41x1.35 smd: 1(-1,0) 2(1,0)
CASE-A_3216
  rect 1.5x1.359 smd: 1(-1.2,0) 2(1.2,0)
F1206
  rect 1.19x1.728 smd: 1(-1.445,0) 2(1.445,0)
HC-49US_L11.5-W4.5-P4.88
  rect 1.5x1.5 hole 0.9: 1(-2.44,0)
  round 1.5 hole 0.9: 2(2.44,0)
HDR-TH_2P-P2.54-V-F
  rect 1.7x1.7 hole 1: 1(-1.27,0)
  round 1.7 hole 1: 2(1.27,0)
HDR-TH_4P-P2.54-V_A2541HWV-4P
  rect 1.8x1.8 hole 1.2: 1(-3.81,0)
  round 1.8 hole 1.2: 2(-1.27,0) 3(1.27,0) 4(3.81,0)
HDR-TH_16P-P2.54-V-M-R2-C8-S2.54
  rect 1.8x1.8 hole 1.2: 1(-8.89,-1.27)
  round 1.8 hole 1.2: 2(-8.89,1.27) 3(-6.35,-1.27) 4(-6.35,1.27) 5(-3.81,-1.27) 6(-3.81,1.27) 7(-1.27,-1.27) 8(-1.27,1.27) 9(1.27,-1.27) 10(1.27,1.27) 11(3.81,-1.27) 12(3.81,1.27) 13(6.35,-1.27) 14(6.35,1.27) 15(8.89,-1.27) 16(8.89,1.27)
HDR-TH_32P-2.54-V-M-R2-C16-S2.54
  rect 1.6x1.6 hole 1.05: 1(-19.05,-1.27)
  round 1.6 hole 1.05: 2(-19.05,1.27) 3(-16.51,-1.27) 4(-16.51,1.27) 5(-13.97,-1.27) 6(-13.97,1.27) 7(-11.43,-1.27) 8(-11.43,1.27) 9(-8.89,-1.27) 10(-8.89,1.27) 11(-6.35,-1.27) 12(-6.35,1.27) 13(-3.81,-1.27) 14(-3.81,1.27) 15(-1.27,-1.27) 16(-1.27,1.27) 17(1.27,-1.27) 18(1.27,1.27) 19(3.81,-1.27) 20(3.81,1.27) 21(6.35,-1.27) 22(6.35,1.27) 23(8.89,-1.27) 24(8.89,1.27) 25(11.43,-1.27) 26(11.43,1.27) 27(13.97,-1.27) 28(13.97,1.27) 29(16.51,-1.27) 30(16.51,1.27) 31(19.05,-1.27) 32(19.05,1.27)
LED0805-RD
  rect 1x1.25 smd: 1(-1.1,0) 2(1.1,0)
LQFP-44_L10.0-W10.0-P0.80-LS12.0-BL
  oval 0.42x1.67 smd: 1(-4,-5.735) 2(-3.2,-5.735) 3(-2.4,-5.735) 4(-1.6,-5.735) 5(-0.8,-5.735) 6(0,-5.735) 7(0.8,-5.735) 8(1.6,-5.735) 9(2.4,-5.735) 10(3.2,-5.735) 11(4,-5.735) 23(4,5.735) 24(3.2,5.735) 25(2.4,5.735) 26(1.6,5.735) 27(0.8,5.735) 28(0,5.735) 29(-0.8,5.735) 30(-1.6,5.735) 31(-2.4,5.735) 32(-3.2,5.735) 33(-4,5.735)
  oval 1.67x0.42 smd: 12(5.735,-4) 13(5.735,-3.2) 14(5.735,-2.4) 15(5.735,-1.6) 16(5.735,-0.8) 17(5.735,0) 18(5.735,0.8) 19(5.735,1.6) 20(5.735,2.4) 21(5.735,3.2) 22(5.735,4) 34(-5.735,4) 35(-5.735,3.2) 36(-5.735,2.4) 37(-5.735,1.6) 38(-5.735,0.8) 39(-5.735,0) 40(-5.735,-0.8) 41(-5.735,-1.6) 42(-5.735,-2.4) 43(-5.735,-3.2) 44(-5.735,-4)
m3梅花孔
  round 1 hole 1: 1(-2.5,0) 1(-1.768,1.768) 1(-1.768,-1.768) 1(0,2.5) 1(0,-2.5) 1(1.768,1.768) 1(1.768,-1.768) 1(2.5,0)
  round 6.5 hole 3.18x3.175: 1(0,0)
R0805
  rect 1.133x1.377 smd: 1(-1,0) 2(1,0)
SOD-123F_L2.8-W1.8-LS3.7-RD
  rect 1x1.2 smd: 1(-1.55,0) 2(1.55,0)
SOT-223-4_L6.5-W3.5-P2.30-LS7.0-BR
  rect 2.47x0.98 smd: 1(2.835,-2.3) 2(2.835,0) 3(2.835,2.3)
  rect 2.47x3.6 smd: 4(-2.835,0)
SW-SMD_4P-L4.5-W4.5-P3.00-LS6.8
  rect 1.4x1.1 smd: 1(-3.25,1.5) 2(3.25,1.5) 3(-3.25,-1.5) 4(3.25,-1.5)
SW-SMD_SS-3235S-LX
  rect 0.7x1.8 smd: 1(-2.5,3.05) 2(0,3.05) 3(2.5,3.05) 4(-2.5,-3.05) 5(0,-3.05) 6(2.5,-3.05)
TYPE-C-SMD_TYPE-C-31-M-16
  oval 1x2 hole 0.5x1.4: 1(-4.32,1.595) 2(4.32,1.595) 3(-4.32,-2.105) 4(4.32,-2.105)
  rect 0.7x1.1 smd: A5(-0.5,2.105) B5(0.5,2.105)
  rect 0.8x1.1 smd: A9(1.52,2.105) B9(-1.52,2.105)
  rect 0.9x1.1 smd: A12(2.75,2.105) B12(-2.75,2.105)

## Nets
As in the schematic.

Pads without a net: hole1 1; hole2 1; hole3 1; hole4 1

## Via types
v1: diameter 0.61, hole 0.305, Top Layer to Bottom Layer, 174 vias

## Routing (per net, layer and track width the routed paths; a pad name or vN(x,y) marks a point on that pad's centre or on a via; arc(x,y) is an arc through that point)
+5V: length 220.4
  Top Layer w0.381: H5.4 83.57,26.77 82.83,27.51 77.51,27.51 77.13,27.89 R2.2 77.13,35.91 77.54,36.31 81.12,36.31 81.61,36.8 81.61,39.24 82.12,39.75 H8.1 ; C6.2 65.05,8.15 65.05,6.12 65.79,5.39 68.15,5.39 68.58,4.96 v1(68.58,2.6) ; U1.38 27.65,25.56 26.97,26.24 26.97,28.83 26.19,29.62 22.43,29.62 21.02,28.2 RESET.2
  Top Layer w0.508: C2.1 17.55,25.81 C3.2 17.6,27.56 18.25,28.2 RESET.2 ; 19.82,41.92 19.79,41.89 RESET.2 ; 19.82,41.92 22.04,41.92 24.26,39.7 R5.2 R6.2 R7.2 R8.2 R9.2 R10.2 R11.2 R12.2 ; 19.82,41.92 R4.2 ; RESET.2 RESET.1 19.81,21.69 C1.1 16.99,19.84 16.2,19.05 16.2,2.54 17.27,1.47 20.27,1.47
  Bottom Layer w0.508: 20.27,1.47 22.45,1.47 23.58,2.6 v1(68.58,2.6) 79.13,2.6 83.57,7.04 H5.1
GND: length 38.3
  Top Layer w0.381: v1(51.29,21.78) v1(51.29,20.65) v1(51.29,19.32) v1(51.29,18.14) 51.29,17.41 v1(51.74,16.97) 52.98,16.97 ; C4.1 52.98,18.17 52.98,16.97 ; 52.98,16.97 v1(54.15,16.97) v1(55.95,16.97) v1(57.63,16.97) 58.34,16.97 v1(58.94,17.57) v1(59.69,18.31) v1(59.69,19.71) v1(59.69,21.08) v1(59.69,22.51) v1(59.69,23.82) v1(59.69,25.05) v1(59.69,26.36) 59.69,27.03 v1(58.95,27.77) 58.24,28.47 v1(57.88,28.47) v1(55.62,28.47) v1(53.97,28.47) 52.85,28.47 ; 52.85,28.47 52.94,28.39 C5.2 ; 52.85,28.47 51.69,28.47 v1(51.31,28.09) v1(51.31,26.76) v1(51.31,25.24) v1(51.31,23.75)
  vias: v1(2.03,42.21) v1(2.03,32.05) v1(2.03,26.97) v1(2.03,21.89) v1(2.03,16.81) v1(7.11,42.21) v1(7.11,32.05) v1(7.11,16.81) v1(7.11,11.73) v1(7.11,6.65) v1(7.11,1.57) v1(12.19,47.29) v1(12.19,37.13) v1(12.19,32.05) v1(12.19,26.97) v1(12.19,21.89) v1(12.19,16.81) v1(12.19,11.73) v1(12.19,6.65) v1(12.19,1.57) v1(17.27,47.29) v1(17.27,37.13) v1(17.27,32.05) v1(17.27,21.89) v1(21.39,32.03) v1(21.49,37.16) v1(21.51,7.06) v1(22.35,47.29) v1(22.73,34.59) v1(23.91,37.16) v1(23.94,32.03) v1(23.96,7.06) v1(24.38,0.91) v1(26.64,7.06) v1(27.43,21.89) v1(27.56,42.98) v1(27.64,3.39) v1(29.54,7.04) v1(30.12,42.98) v1(30.19,4.6) v1(32.22,7.21) v1(32.51,21.89) v1(32.67,4.6) v1(32.79,42.98) v1(35.24,4.6) v1(35.27,42.98) v1(37.8,42.98) v1(37.82,4.6) v1(40.21,6.86) v1(40.36,42.98) v1(42.44,17.2) v1(42.44,14.66) v1(42.44,11.97) v1(42.84,42.98) v1(42.79,6.86) v1(44.07,17.22) v1(44.07,14.66) v1(44.07,11.98) v1(45.34,6.86) v1(45.76,42.98) v1(47.88,47.42) v1(47.96,4.62) v1(50.4,47.42) v1(50.42,7.19) v1(50.52,43) v1(52.96,8.66) v1(53.1,47.42) v1(55.16,8.66) v1(55.66,47.42) v1(57.81,11.2) v1(57.91,37.13) v1(58.21,47.42) v1(60.74,47.42) v1(62.99,47.29) v1(62.99,21.89) v1(62.99,16.81) v1(62.99,11.73) v1(68.07,11.73) v1(68.07,1.57) v1(73.15,42.21) v1(73.15,32.05) v1(73.15,26.97) v1(73.15,21.89) v1(73.15,16.81) v1(73.15,6.65) v1(73.15,1.57) v1(77.04,21.87) v1(77.16,16.71) v1(77.27,25.91) v1(78.23,42.21) v1(78.23,6.65) v1(78.23,1.57) v1(79.7,21.87) v1(79.74,16.71) v1(79.83,25.91) v1(83.31,42.21) v1(83.31,37.13) v1(88.39,42.21) v1(88.39,26.97)
VCC: length 34.4
  Top Layer w0.508: 4.44,26.05 4.44,33.58 4.95,34.09 7.43,34.09 ON.4 ON.5 ; 4.44,26.05 4.45,26.06 USB1.B9 ; 4.44,26.05 4.44,23.02 ; 4.44,23.02 4.44,12.75 3.58,11.89 POWERIN.1 ; 4.44,23.02 4.45,23.02 USB1.A9
VCCX: length 2.7
  Top Layer w0.508: ON.6 10.14,39.05 F1.1
P00: length 34.4
  Top Layer w0.381: v1(24.77,41.68) 26.33,41.68 R5.1 26.35,41.7 H1.1 H1.2 ; v1(24.77,37.97) 28.47,34.26 28.47,27.86 29.97,26.36 U1.37
  Bottom Layer w0.381: v1(24.77,37.97) v1(24.77,41.68)
P01: length 31.8
  Top Layer w0.381: v1(27.61,38.02) 29.34,36.3 29.34,28.35 30.52,27.17 U1.36 ; H1.4 H1.3 28.89,41.7 R6.1 27.64,41.7 v1(27.61,41.73)
  Bottom Layer w0.381: v1(27.61,38.02) v1(27.61,41.73)
P02: length 29.8
  Top Layer w0.381: v1(30.1,37.77) 30.1,28.83 30.96,27.97 U1.35 ; v1(30.1,41.71) 30.11,41.7 R7.1 31.43,41.7 H1.5 H1.6
  Bottom Layer w0.381: v1(30.1,37.77) v1(30.1,41.71)
P03: length 26.4
  Top Layer w0.381: v1(32.77,41.71) 32.78,41.7 R8.1 33.97,41.7 H1.7 H1.8 ; v1(32.74,37.82) 32.74,29.34 33.31,28.77 U1.34
  Bottom Layer w0.381: v1(32.74,37.82) 32.77,37.85 v1(32.77,41.71)
P04: length 23.5
  Top Layer w0.381: v1(35.2,37.82) 35.2,33.27 36.04,32.44 39.42,32.44 40.04,31.81 U1.33 ; H1.10 H1.9 36.51,41.7 R9.1 36.5,41.71 v1(35.25,41.71)
  Bottom Layer w0.381: v1(35.2,37.82) 35.25,37.87 v1(35.25,41.71)
P05: length 21.5
  Top Layer w0.381: U1.32 40.84,32.03 39.75,33.12 38.33,33.12 37.79,33.66 v1(37.79,37.82) ; H1.12 H1.11 39.05,41.7 R10.1 39.01,41.66 v1(37.79,41.66)
  Bottom Layer w0.381: v1(37.79,37.82) v1(37.79,41.66)
P06: length 20
  Top Layer w0.381: U1.31 41.64,32.27 40.41,33.5 v1(40.41,37.8) ; H1.14 H1.13 41.59,41.7 R11.1 40.35,41.7 v1(40.34,41.68)
  Bottom Layer w0.381: v1(40.34,41.68) 40.34,37.87 v1(40.41,37.8)
P07: length 19.6
  Top Layer w0.381: v1(42.9,37.74) 42.9,35.18 42.44,34.72 U1.30 ; v1(42.9,41.66) 44.09,41.66 R12.1 44.13,41.7 H1.15 H1.16
  Bottom Layer w0.381: v1(42.9,37.74) v1(42.9,41.66)
P10: length 44.5
  Top Layer w0.381: v1(34.01,23.93) 34.05,23.97 U1.40 ; H2.1 H2.2 22.53,3.81 20.25,6.09 LED1.2 20.26,9.73 v1(21.56,9.73)
  Bottom Layer w0.381: v1(34.01,23.93) 34.01,15.01 33.15,14.15 22.5,14.15 21.56,13.21 v1(21.56,9.73)
P11: length 41
  Top Layer w0.381: v1(24.1,9.73) 22.8,9.73 LED2.2 22.79,6.47 24.31,4.95 27.75,4.95 H2.4 H2.3 ; U1.41 v1(34.72,23.17)
  Bottom Layer w0.381: v1(24.1,9.73) 24.1,12.55 24.89,13.33 33.83,13.33 34.71,14.21 34.71,23.15 v1(34.72,23.17)
P12: length 38.1
  Top Layer w0.381: H2.5 H2.6 31.43,4.92 30.81,5.54 26.72,5.54 25.33,6.93 LED3.2 25.34,9.73 v1(26.59,9.73) ; U1.42 35.37,22.36 v1(35.36,22.38)
  Bottom Layer w0.381: v1(26.59,9.73) 26.59,11.76 27.25,12.42 34.39,12.42 35.34,13.37 35.34,22.36 v1(35.36,22.38)
P13: length 34.8
  Top Layer w0.381: H2.7 H2.8 33.97,5.07 33.02,6.02 29.01,6.02 27.87,7.16 LED4.2 29.17,9.74 v1(29.18,9.75) ; U1.43 v1(35.99,21.56)
  Bottom Layer w0.381: v1(29.18,9.75) 29.18,11.25 29.51,11.58 35,11.58 35.99,12.57 v1(35.99,21.56)
P14: length 31.7
  Top Layer w0.381: H2.9 H2.10 36.51,5.6 35.61,6.5 31.24,6.5 30.41,7.34 LED5.2 30.42,9.73 v1(31.67,9.73) ; U1.44 v1(36.68,20.77)
  Bottom Layer w0.381: v1(31.67,9.73) 31.67,10.54 32.03,10.9 35.71,10.9 36.68,11.86 v1(36.68,20.77)
P15: length 29.7
  Top Layer w0.381: v1(34.19,9.73) 32.96,9.73 LED6.2 32.95,7.69 33.65,6.99 38.02,6.99 39.05,5.96 H2.12 H2.11 ; U1.1 v1(40.04,12.75)
  Bottom Layer w0.381: v1(40.04,12.75) 40.04,10.2 39.57,9.73 v1(34.19,9.73)
P16: length 27.5
  Top Layer w0.381: H2.13 H2.14 41.6,3.82 41.6,6.83 40.87,7.57 35.92,7.57 35.49,8 LED7.2 36.56,10.82 40.18,10.82 40.84,11.48 U1.2
P17: length 26.6
  Top Layer w0.381: U1.3 41.64,10.22 41.12,9.7 38.06,9.7 LED8.2 38.03,8.58 38.53,8.08 43.54,8.08 44.15,7.47 44.15,3.82 H2.16 H2.15
P20: length 58.9
  Top Layer w0.381: U1.18 v1(44.07,25.56) ; SW1/P20.2 SW1/P20.1 67.25,48.68 H1.32 H1.31
  Bottom Layer w0.381: H1.31 64.45,35.39 62.99,33.93 45.59,33.93 44.07,32.41 v1(44.07,25.56)
P21: length 63.6
  Top Layer w0.381: SW2/P21.2 SW2/P21.1 68.76,42.16 68.28,42.65 63.58,42.65 61.91,44.31 H1.29 H1.30 ; U1.19 v1(43.38,26.36)
  Bottom Layer w0.381: H1.29 61.91,35.6 60.93,34.62 44.88,34.62 43.38,33.12 v1(43.38,26.36)
P22: length 43.5
  Top Layer w0.381: U1.20 v1(42.67,27.17) ; H1.28 H1.27
  Bottom Layer w0.381: v1(42.67,27.17) 42.67,33.98 43.97,35.28 57.51,35.28 59.37,37.15 H1.27
P23: length 42
  Top Layer w0.381: U1.21 v1(42.01,27.97) ; H1.26 H1.25
  Bottom Layer w0.381: v1(42.01,27.97) 42.01,28.5 42.02,28.51 42.02,29.05 42.01,29.06 42.01,34.54 43.41,35.94 55.93,35.94 56.84,36.86 56.84,46.13 H1.25
P24: length 39.9
  Top Layer w0.381: U1.22 49.71,28.83 v1(41.36,28.83) ; H1.24 H1.23
  Bottom Layer w0.381: H1.23 54.29,37.38 53.52,36.6 42.77,36.6 41.36,35.19 v1(41.36,28.83)
P25: length 19.7
  Top Layer w0.381: U1.23 48.04,33.11 51.75,36.82 H1.21 H1.22
P26: length 19
  Top Layer w0.381: U1.24 47.24,33.2 49.21,35.17 H1.19 H1.20
P27: length 19.5
  Top Layer w0.381: U1.25 46.44,33.49 48.16,35.2 48.16,44.65 H1.17 H1.18
P30: length 116.1
  Top Layer w0.381: H2.17 H2.18 46.67,8.24 46.28,8.64 43.81,8.64 43.24,9.21 U1.5 43.22,19.06 v1(43.22,23.22) ; TXD.2 88.51,34.66 H8.3
  Bottom Layer w0.381: H8.3 87.07,34.67 86.63,34.23 86.63,30.7 85.85,29.92 79.15,29.92 78.08,28.85 78.08,14.5 76.96,13.39 62.74,13.39 61.85,14.28 61.85,29.18 60.81,30.23 48.31,30.23 47.14,29.06 47.14,23.6 46.76,23.22 v1(43.22,23.22)
P31: length 112.5
  Top Layer w0.254: 88.51,32.12 H8.4
  Top Layer w0.381: RXD.2 88.51,32.12 ; v1(44.88,22.5) 44.84,22.47 U1.7 44.84,10.3 45.62,9.53 48.56,9.53 49.22,8.86 49.22,3.82 H2.20 H2.19
  Bottom Layer w0.381: v1(44.88,22.5) 47.12,22.5 47.88,23.27 47.88,28.42 48.95,29.49 60.45,29.49 61.21,28.73 61.21,13.87 62.46,12.62 77.27,12.62 78.82,14.17 78.82,28.27 79.68,29.13 87.78,29.13 88.52,29.87 H8.4
P32: length 22.9
  Top Layer w0.381: U1.8 45.64,10.97 46.41,10.21 50.88,10.21 51.69,9.4 51.69,3.87 H2.22 H2.21
P33: length 24.7
  Top Layer w0.381: U1.9 46.44,11.85 47.29,11 53.49,11 54.31,10.19 54.31,3.82 H2.24 H2.23
P34: length 26.3
  Top Layer w0.381: U1.10 47.24,12.85 48.31,11.79 56.03,11.79 56.87,10.95 56.87,3.85 H2.26 H2.25
P35: length 27.7
  Top Layer w0.381: H2.27 H2.28 59.37,11.42 58.19,12.6 49.22,12.6 48.04,13.78 U1.11
P36: length 34.8
  Top Layer w0.381: U1.12 v1(47.57,20.77) ; H2.29 H2.30
  Bottom Layer w0.381: v1(47.57,20.77) 47.57,7.26 49.07,5.77 61.24,5.77 61.91,5.09 H2.30
P37: length 37
  Top Layer w0.381: H2.31 H2.32 ; U1.13 v1(48.23,21.56)
  Bottom Layer w0.381: H2.32 64.45,5.53 63.73,6.25 49.28,6.25 48.23,7.29 v1(48.23,21.56)
P40: length 35.8
  Top Layer w0.381: U1.17 v1(44.96,24.77) ; J1.1 J1.2
  Bottom Layer w0.381: v1(44.96,24.77) 44.96,31.67 46.15,32.87 63.25,32.87 64.03,33.66 J1.1
P41: length 46.2
  Top Layer w0.381: v1(52.68,40.56) 52.68,42.67 53.06,43.05 61.77,43.05 63.67,41.16 63.67,31.5 64.05,31.11 J1.3 J1.4 ; U1.28 44.04,34.21 45.57,35.74 v1(45.57,40.56)
  Bottom Layer w0.381: v1(45.57,40.56) v1(52.68,40.56)
P42: length 39.7
  Top Layer w0.381: U1.39 v1(43.08,24.77) ; J1.5 J1.6
  Bottom Layer w0.381: v1(43.08,24.77) 43.92,23.93 45.16,23.93 45.76,24.53 45.76,30.67 47.02,31.93 62.46,31.93 63.53,30.86 63.53,28.93 63.93,28.52 65.61,28.52 J1.5
P43: length 39
  Top Layer w0.381: J1.7 J1.8 ; v1(46.38,23.9) 44.65,23.9 44.04,23.29 U1.6
  Bottom Layer w0.381: J1.7 63.68,26.03 62.66,27.05 62.66,30.12 61.75,31.04 47.6,31.04 46.38,29.82 v1(46.38,23.9)
P44: length 50.9
  Top Layer w0.381: U1.26 45.64,33.76 47.24,35.36 v1(47.24,42.22) ; v1(53.52,42.16) 61.47,42.16 62.64,41 62.64,24.28 63.42,23.5 J1.9 J1.10
  Bottom Layer w0.381: v1(53.52,42.16) 53.47,42.22 v1(47.24,42.22)
P45: length 52.7
  Top Layer w0.381: v1(46.39,41.35) 46.39,35.52 44.84,33.97 U1.27 ; v1(53.49,41.35) 60.63,41.35 61.75,40.23 61.75,21.62 62.41,20.95 J1.11 J1.12
  Bottom Layer w0.381: v1(46.39,41.35) v1(53.49,41.35)
P46: length 50.9
  Top Layer w0.381: U1.29 43.24,34.56 44.73,36.04 v1(44.73,38.35) ; v1(53.49,38.38) 59.97,38.38 60.86,37.49 60.86,19.25 61.7,18.42 J1.13 J1.14
  Bottom Layer w0.381: v1(44.73,38.35) 53.47,38.35 v1(53.49,38.38)
RST: length 33.8
  Top Layer w0.381: U1.4 42.44,20.45 v1(42.47,20.47) ; RESET.3 22.79,21.57 22.21,20.99 C1.2 ; RESET.3 22.8,21.72 24.64,21.72 24.97,22.05 R1.1 24.98,23.93 v1(26.8,23.93) ; RESET.3 RESET.4
  Bottom Layer w0.381: v1(42.47,20.47) 38.68,20.47 34.49,24.66 27.53,24.66 v1(26.8,23.93)
XTAL1: length 9
  Top Layer w0.254: X1.1 56.82,25.15 C5.1 53.01,25.08 53.01,23.44 52.73,23.17 U1.15
XTAL2: length 9.1
  Top Layer w0.254: U1.14 52.62,22.36 52.94,22.04 C4.2 56.8,20.2 X1.2
$1N5139: length 2.4
  Top Layer w0.381: R2.1 81.45,32.14 RXD.1
$1N5140: length 2.3
  Top Layer w0.381: TXD.1 81.45,34.68 R3.1
$1N5141: length 3.3
  Top Layer w0.381: PWR.1 15.93,36.67 R4.1
$2N1911: length 2.4
  Top Layer w0.254: R24.1 LED8.1
$2N1912: length 34.1
  Top Layer w0.381: R24.2 37.99,16.41 18.44,16.41 18.06,16.03 18.06,4.39 18.44,4.01 H7.2
$2N1913: length 2.4
  Top Layer w0.254: R23.1 LED7.1
$2N1914: length 2.4
  Top Layer w0.254: R21.1 LED5.1
$2N1915: length 2.4
  Top Layer w0.254: R22.1 LED6.1
$2N1922: length 2.4
  Top Layer w0.254: R20.1 LED4.1
$2N1923: length 2.4
  Top Layer w0.254: R19.1 LED3.1
$2N1932: length 2.4
  Top Layer w0.254: R18.1 LED2.1
$2N1933: length 2.4
  Top Layer w0.254: R17.1 LED1.1
$2N1937: length 12.8
  Top Layer w0.381: R14.2 80.5,40.12 81.08,40.69 H3.2 79.71,42.82 79.35,43.18 79.35,46.51 78.98,46.87 R13.2
$2N1939: length 9.1
  Top Layer w0.381: 77.7,44.59 77.26,44.59 76.83,44.17 SW1/P20.4 SW1/P20.3
$2N1940: length 9.2
  Top Layer w0.381: SW2/P21.3 SW2/P21.4 77.05,37.46 R14.1
$2N2109: length 2.6
  Top Layer w0.254: R16.2 8.29,24.04 USB1.B5
$2N2110: length 2.7
  Top Layer w0.254: USB1.A5 8.19,25.04 R15.2

## Copper pours and planes (outline as drawn; the poured copper is in the pictures)
3V3 on Top Layer: 68.45,11.02 73,11.02 74.24,12.27 86.72,12.27 87.38,12.93 87.38,13.61 87.3,24.46 89.71,24.41 89.71,9.6 77.27,9.6 77.27,8.97 76.94,8.53 74.12,8.53 72.95,9.7 68.48,9.7 68.45,9.7
+5V on Top Layer: 64.18,8.91 71.13,8.91 71.13,7.11 64.18,7.11
+5V on Top Layer: 9.22,42.78 16.71,42.78 16.71,41.22 9.22,41.22
+5V on Top Layer: 82.35,24.3 84.85,24.3 84.85,13.64 82.35,13.64
GND on Top Layer: -1.88,52.07 93.14,52.07 93.14,-2.46 -1.88,-2.46
GND on Bottom Layer: -2.26,52.32 93.22,52.32 93.22,-3.68 -2.26,-3.68

Small or netless copper shapes (teardrops, artwork), in the pictures only: 409 on Top Layer, 55 on Bottom Layer

## Text on the board
Top Silkscreen Layer: P10 | P00 | P11 | P01 | P12 | P02 | P13 | P03 | P14 | P04 | P15 | P05 | P16 | P06 | P17 | P07 | P30 | P27 | P31 | P26 | P32 | P25 | P33 | P24 | P34 | P23 | P35 | P22 | P36 | P21 | P37 | P20 | +5V | GND | 5V | EN | P40 | P41 | P42 | P43 | P44 | P45 | P46 | 3V3 | VCC | ON<->OFF | LED-ENABLE | STC89C52RC
